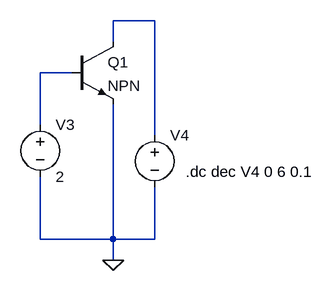
[diagram p0: schematic Vbe=2V.asc]
Vbe=2V.asc, the LTspice schematic file:
Version 4.1
SHEET 1 880 680
WIRE 288 64 224 64
WIRE 224 96 224 64
WIRE 160 144 112 144
WIRE 112 224 112 144
WIRE 288 240 288 64
WIRE 112 400 112 304
WIRE 224 400 224 192
WIRE 224 400 112 400
WIRE 288 400 288 320
WIRE 288 400 224 400
WIRE 224 432 224 400
FLAG 224 432 0
SYMBOL npn 160 96 R0
SYMATTR InstName Q1
SYMBOL voltage 112 208 R0
WINDOW 123 0 0 Left 0
WINDOW 39 0 0 Left 0
SYMATTR InstName V3
SYMATTR Value 2
SYMBOL voltage 288 224 R0
WINDOW 123 0 0 Left 0
WINDOW 39 0 0 Left 0
SYMATTR InstName V4
SYMATTR Value ""
TEXT 336 296 Left 2 !.dc dec V4 0 6 0.1

The netlist it stands for:
* Vbe=2V.asc
Q1 N001 N002 0 0 NPN
V3 N002 0 2
V4 N001 0
.model NPN NPN
.model PNP PNP
.lib standard.bjt
.dc dec V4 0 6 0.1
.backanno
.end